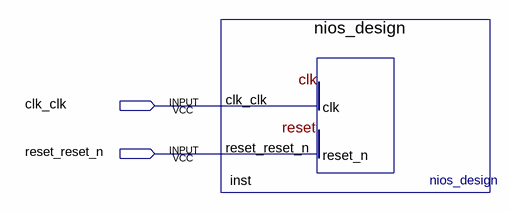
[diagram p0: schematic sheet]
// Quartus schematic Math.bdf as structural Verilog: 1 symbols, 2 pins
module Math (
  input  clk_clk,
  input  reset_reset_n
);

  nios_design inst (.clk_clk(clk_clk), .reset_reset_n(reset_reset_n));
endmodule
